# Altium schematic sheet Analog.SchDoc
size A4; SheetNumber: 3; SheetTotal: 13
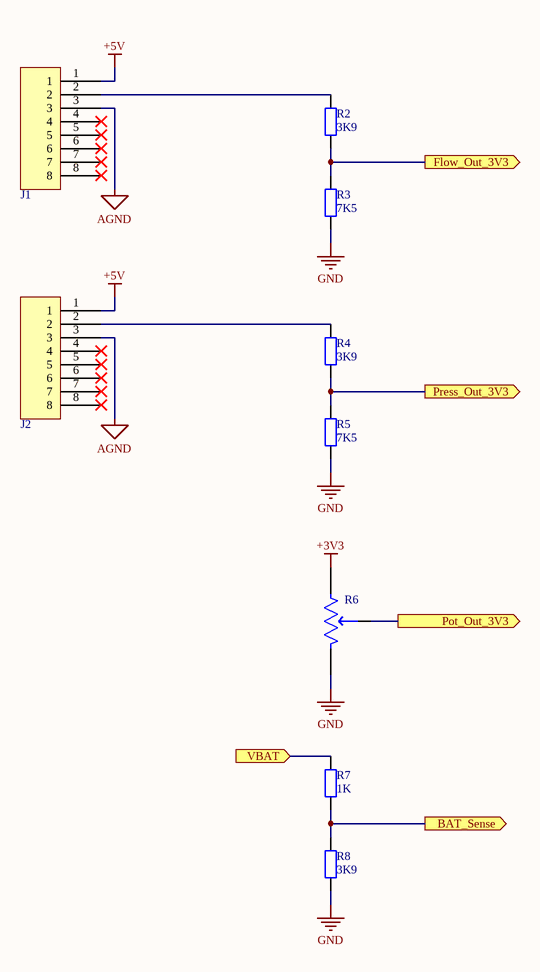
[diagram p0: Analog.SchDoc]

## Parts
J1  MTJ-885X1  [MTJ-885X1]  (value not drawn)
J2  MTJ-885X1  [MTJ-885X1]  (value not drawn)
R2  3K9  [RES 0603/1608]
R3  7K5  [RES 0603/1608]
R4  3K9  [RES 0603/1608]
R5  7K5  [RES 0603/1608]
R6  PDB12-H4301-103BF  [PDB12-H4301-103BF]  (value not drawn)
R7  1K  [RES 0603/1608]
R8  3K9  [RES 0603/1608]

## Ports
BAT_Sense (out), Flow_Out_3V3 (out), Pot_Out_3V3 (out), Press_Out_3V3 (out), VBAT (in)

## Nets
+3V3: R6.1
+5V: J1.1 J2.1
AGND: J1.3 J2.3
GND: R3.1 R5.1 R6.3 R8.1
BAT_Sense: R7.1 R8.2 ; port BAT_Sense
Flow_Out_3V3: R2.1 R3.2 ; port Flow_Out_3V3
Pot_Out_3V3: R6.2 ; port Pot_Out_3V3
Press_Out_3V3: R4.1 R5.2 ; port Press_Out_3V3
VBAT: R7.2 ; port VBAT
NetJ1_2: J1.2 R2.2
NetJ2_2: J2.2 R4.2

Not connected (* = marked no-connect by the designer): J1 4* 5* 6* 7* 8*; J2 4* 5* 6* 7* 8*

## Library data of the parts
J1 J2 = MTJ-885X1: manufacturer: MODULAR JACK RJ45 8P8C; inventory_price: 0.97; partnumber: MTJ-885X1; Manufacturer Part Number: MTJ-885X1; URL Datasheet: https://app.adam-tech.com/products/download/data_sheet/203809/mtj-885x1-data-sheet.pdf; Digikey PN: 2057-MTJ-885X1-ND; parttype: Modular Connectors - Jacks
R2 R4 R8 = RC0603FR-073K9L: RES SMD 3.9K OHM 1% 1/10W 0603; Manufacturer: Yageo; Package Imperial: 0603; Package Metric: 1608; Temperature Coefficient: ±100ppm/°C; Power (Watts): 0.1W, 1/10W; Part Number: RC0603FR-073K9L; Value: 3K9; Tolerance: ±1%; Digi-Key Part Number: 311-3.90KHRCT-ND
R3 R5 = RC0603FR-077K5L: RES SMD 7.5K OHM 1% 1/10W 0603; Manufacturer: Yageo; Package Imperial: 0603; Package Metric: 1608; Temperature Coefficient: ±100ppm/°C; Power (Watts): 0.1W, 1/10W; Part Number: RC0603FR-077K5L; Value: 7K5; Tolerance: ±1%; Digi-Key Part Number: 311-7.50KHRCT-ND
R6 = PDB12-H4301-103BF: Variable Resistor Symbol; manufacturer: Bourns Inc.; inventory_price: 1.49; partnumber: PDB12-H4301-103BF; Manufacturer Part Number: PDB12-H4301-103BF; URL Datasheet: https://www.bourns.com/docs/Product-Datasheets/PDB12.pdf; Digikey PN: PDB12-H4301-103BF-ND; parttype: Rotary Potentiometers, Rheostats
R7 = RC0603FR-071KL: RES SMD 1K OHM 1% 1/10W 0603; Manufacturer: Yageo; Package Imperial: 0603; Package Metric: 1608; Temperature Coefficient: ±100ppm/°C; Power (Watts): 0.1W, 1/10W; Part Number: RC0603FR-071KL; Value: 1K; Tolerance: ±1%; Digi-Key Part Number: 311-1.00KHRCT-ND